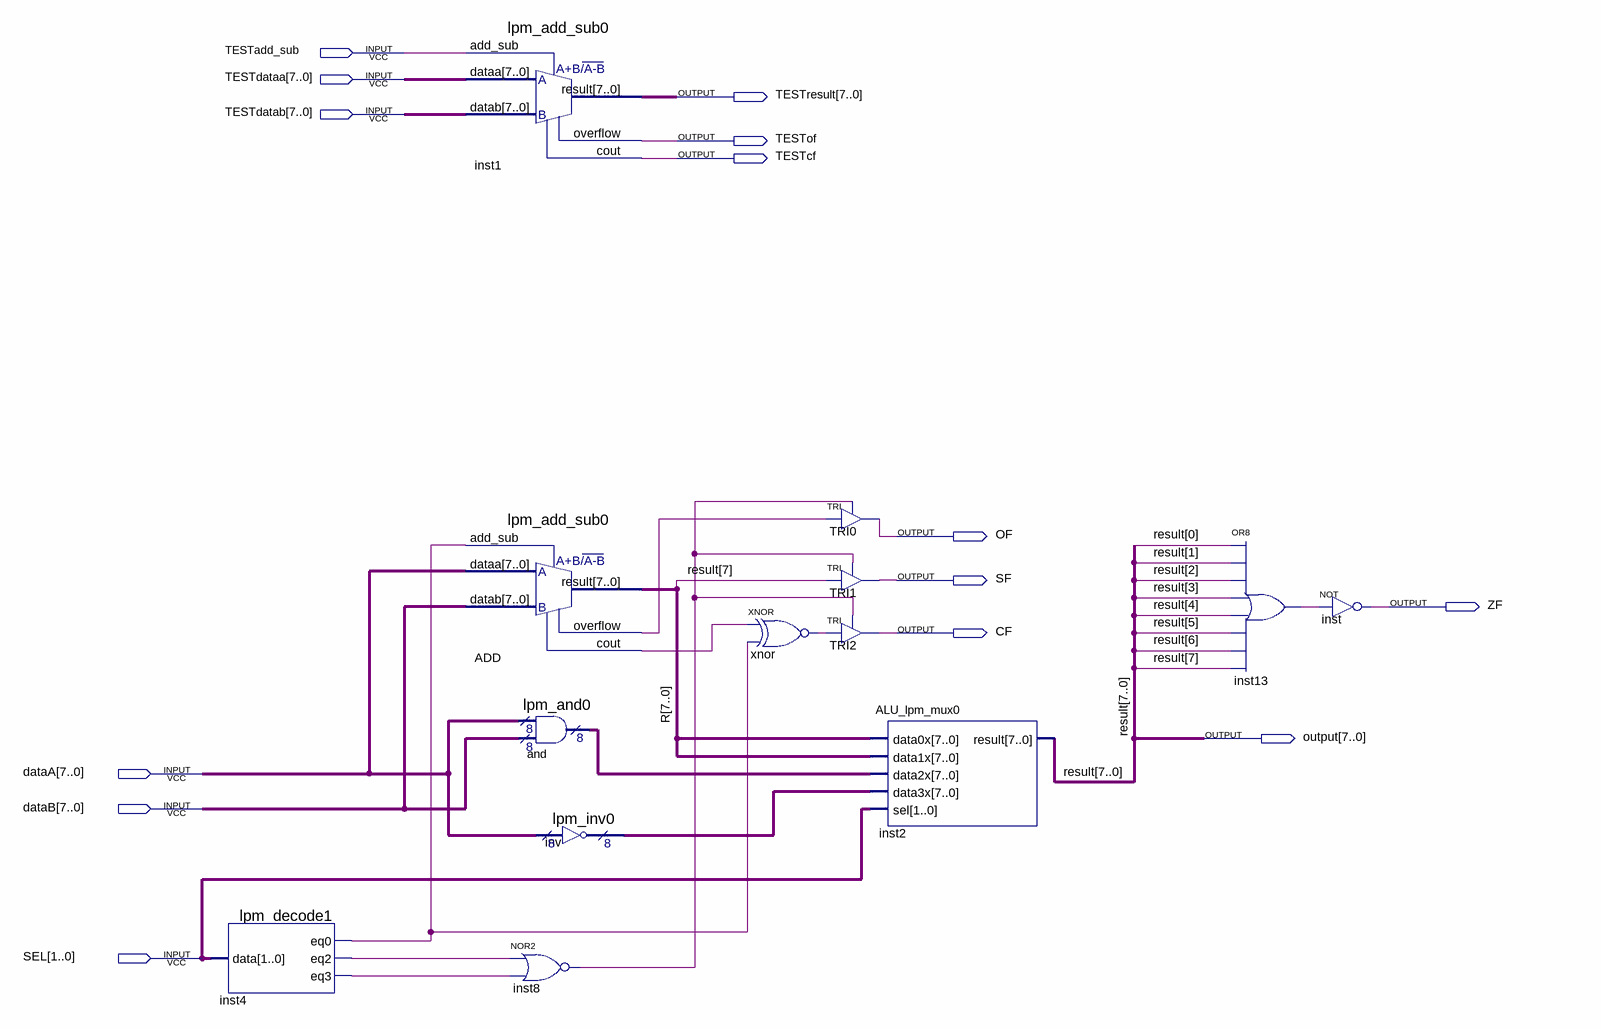
[diagram p0: schematic sheet]
// Quartus schematic ALU.bdf as structural Verilog: 13 symbols, 14 pins
module ALU (
  input  TESTadd_sub,
  input  [7:0] TESTdataa,
  input  [7:0] TESTdatab,
  input  [7:0] dataA,
  input  [7:0] dataB,
  input  [1:0] SEL,
  output [7:0] TESTresult,
  output TESTof,
  output TESTcf,
  output OF,
  output SF,
  output ZF,
  output CF,
  output [7:0] \output 
);

  wire ADD_cout, ADD_overflow, inst4_eq0, inst4_eq2, inst4_eq3, inst8_out, inst13_out, xnor_out;
  wire [7:0] and_result, inv_result, R;

  lpm_decode1 inst4 (.data(SEL), .eq0(inst4_eq0), .eq2(inst4_eq2), .eq3(inst4_eq3));
  lpm_add_sub0 inst1 (
    .dataa(TESTdataa), .datab(TESTdatab), .add_sub(TESTadd_sub), .result(TESTresult), .overflow(TESTof),
    .cout(TESTcf));
  lpm_add_sub0 ADD (
    .dataa(dataA), .datab(dataB), .add_sub(inst4_eq0), .result(R), .overflow(ADD_overflow), .cout(ADD_cout));
  lpm_and0 \and  (.data0x(dataA), .data1x(dataB), .result(and_result));
  lpm_inv0 inv (.data(dataA), .result(inv_result));
  nor inst8 (inst8_out, inst4_eq2, inst4_eq3);
  xnor \xnor  (xnor_out, ADD_cout, inst4_eq0);
  TRI TRI0 (.IN(ADD_overflow), .OE(inst8_out), .OUT(OF));
  TRI TRI1 (.IN(\output [7]), .OE(inst8_out), .OUT(SF));
  TRI TRI2 (.IN(xnor_out), .OE(inst8_out), .OUT(CF));
  ALU_lpm_mux0 inst2 (.data0x(R), .data1x(R), .data2x(and_result), .data3x(inv_result), .sel(SEL), .result(\output ));
  or inst13 (inst13_out, \output [0], \output [1], \output [2], \output [3], \output [4], \output [5], \output [6], \output [7]);
  not inst (ZF, inst13_out);

  // Other names for the same wires on the sheet: result[7:0] = \output 
endmodule
